# Altium project 1lED.PrjPcb
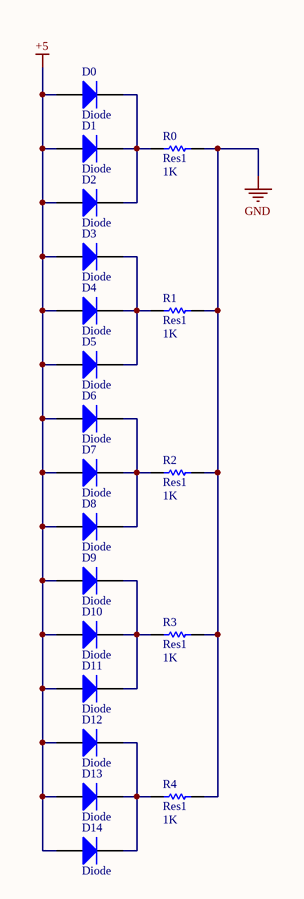
[diagram p0: ledring.SchDoc]
1 sheet, 20 parts. Net scope: global (net labels, ports and power ports of the same name join across sheets).
Board file: LEDringTHErightWAY.PcbDoc

## Sheet ledring.SchDoc
size A

### Parts
D0  Diode  [SMC]
D1  Diode  [SMC]
D2  Diode  [SMC]
D3  Diode  [SMC]
D4  Diode  [SMC]
D5  Diode  [SMC]
D6  Diode  [SMC]
D7  Diode  [SMC]
D8  Diode  [SMC]
D9  Diode  [SMC]
D10  Diode  [SMC]
D11  Diode  [SMC]
D12  Diode  [SMC]
D13  Diode  [SMC]
D14  Diode  [SMC]
R0  Res1  value 1K  [AXIAL-0.3]
R1  Res1  value 1K  [AXIAL-0.3]
R2  Res1  value 1K  [AXIAL-0.3]
R3  Res1  value 1K  [AXIAL-0.3]
R4  Res1  value 1K  [AXIAL-0.3]

### Nets
+5: D0.1(A) D1.1(A) D2.1(A) D3.1(A) D4.1(A) D5.1(A) D6.1(A) D7.1(A) D8.1(A) D9.1(A) D10.1(A) D11.1(A) D12.1(A) D13.1(A) D14.1(A)
GND: R0.2 R1.2 R2.2 R3.2 R4.2
NetD0_2: D0.2(K) D1.2(K) D2.2(K) R0.1
NetD3_2: D3.2(K) D4.2(K) D5.2(K) R1.1
NetD6_2: D6.2(K) D7.2(K) D8.2(K) R2.1
NetD9_2: D9.2(K) D10.2(K) D11.2(K) R3.1
NetD12_2: D12.2(K) D13.2(K) D14.2(K) R4.1

### Library data of the parts
D0-D14 = Diode: Default Diode; Published: 8-Jun-2000; LatestRevisionDate: 17-Jul-2002; LatestRevisionNote: Re-released for DXP Platform.; PackageVersion: Sep-1996; PackageReference: SMC; Publisher: Altium Limited; PackageDescription: DO-214-AB/SMC; 2 C-Bend Leads; Body 7.9 x 5.9 mm, inc. leads (LxW); Code_JEDEC: DO-214-AB
R0-R4 = Res1: Resistor; Published: 8-Jun-2000; LatestRevisionDate: 17-Jul-2002; LatestRevisionNote: Re-released for DXP Platform.; PackageReference: AXIAL-0.3; Publisher: Altium Limited; PackageDescription: Axial Device, Thru-Hole; 2 Leads; 0.3 in Pin Spacing